# Altium schematic sheet DfMUX_DAC.SchDoc: Digital fMUX Mezzanine - DAC
size 386 x 246 mm; Engineer: M.Dobbs, McGill U.; Revision: 4
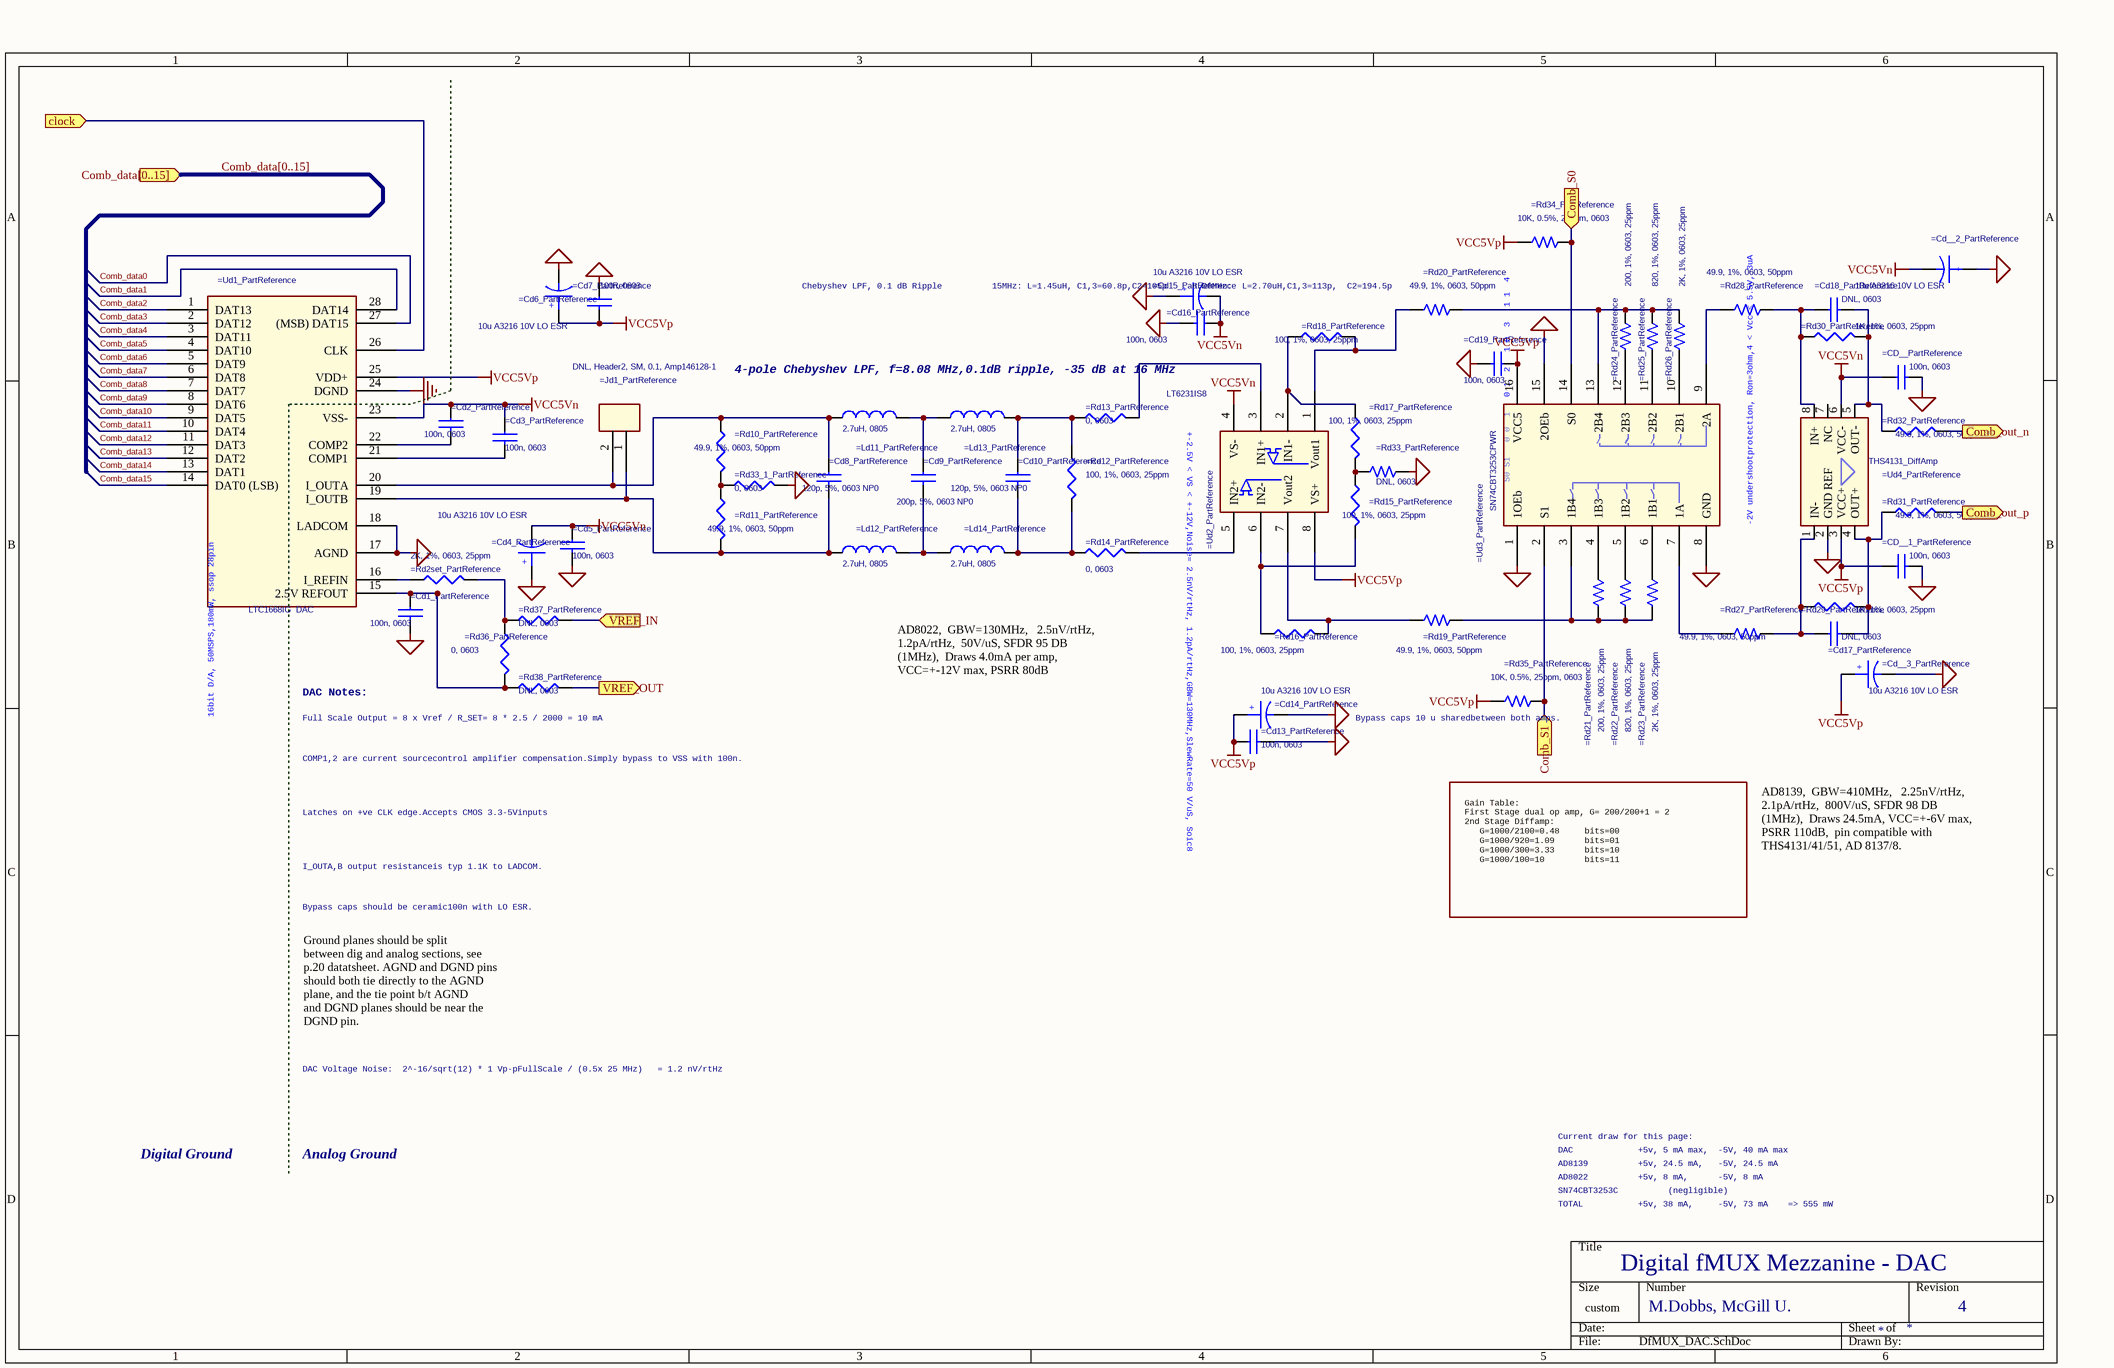
[diagram p0: DfMUX_DAC.SchDoc]

## Parts
=Cd1_PartReference  100n, 0603  [0603C]
=Cd2_PartReference  100n, 0603  [0603C]
=Cd3_PartReference  100n, 0603  [0603C]
=Cd4_PartReference  10u A3216 10V LO ESR  [TANTA]
=Cd5_PartReference  100n, 0603  [0603C]
=Cd6_PartReference  10u A3216 10V LO ESR  [TANTA]
=Cd7_PartReference  100n, 0603  [0603C]
=Cd8_PartReference  120p, 5%, 0603 NP0  [0603C]
=Cd9_PartReference  200p, 5%, 0603 NP0  [0603C]
=Cd10_PartReference  120p, 5%, 0603 NP0  [0603C]
=Cd13_PartReference  100n, 0603  [0603C]
=Cd14_PartReference  10u A3216 10V LO ESR  [TANTA]
=Cd15_PartReference  10u A3216 10V LO ESR  [TANTA]
=Cd16_PartReference  100n, 0603  [0603C]
=Cd17_PartReference  DNL, 0603  [0603C]
=Cd18_PartReference  DNL, 0603  [0603C]
=Cd19_PartReference  100n, 0603  [0603C]
=CD__1_PartReference  100n, 0603  [0603C]
=Cd__2_PartReference  10u A3216 10V LO ESR  [TANTA]
=Cd__3_PartReference  10u A3216 10V LO ESR  [TANTA]
=CD__PartReference  100n, 0603  [0603C]
=Jd1_PartReference  DNL, Header2, SM, 0.1, Amp146128-1  [HEADER_AMP146128]
=Ld11_PartReference  2.7uH, 0805  [0805L]
=Ld12_PartReference  2.7uH, 0805  [0805L]
=Ld13_PartReference  2.7uH, 0805  [0805L]
=Ld14_PartReference  2.7uH, 0805  [0805L]
=Rd2set_PartReference  2K, 1%, 0603, 25ppm  [0603R]
=Rd10_PartReference  49.9, 1%, 0603, 50ppm  [0603R]
=Rd11_PartReference  49.9, 1%, 0603, 50ppm  [0603R]
=Rd12_PartReference  100, 1%, 0603, 25ppm  [0603R]
=Rd13_PartReference  0, 0603  [0603R]
=Rd14_PartReference  0, 0603  [0603R]
=Rd15_PartReference  100, 1%, 0603, 25ppm  [0603R]
=Rd16_PartReference  100, 1%, 0603, 25ppm  [0603R]
=Rd17_PartReference  100, 1%, 0603, 25ppm  [0603R]
=Rd18_PartReference  100, 1%, 0603, 25ppm  [0603R]
=Rd19_PartReference  49.9, 1%, 0603, 50ppm  [0603R]
=Rd20_PartReference  49.9, 1%, 0603, 50ppm  [0603R]
=Rd21_PartReference  200, 1%, 0603, 25ppm  [0603R]
=Rd22_PartReference  820, 1%, 0603, 25ppm  [0603R]
=Rd23_PartReference  2K, 1%, 0603, 25ppm  [0603R]
=Rd24_PartReference  200, 1%, 0603, 25ppm  [0603R]
=Rd25_PartReference  820, 1%, 0603, 25ppm  [0603R]
=Rd26_PartReference  2K, 1%, 0603, 25ppm  [0603R]
=Rd27_PartReference  49.9, 1%, 0603, 50ppm  [0603R]
=Rd28_PartReference  49.9, 1%, 0603, 50ppm  [0603R]
=Rd29_PartReference  1K, 1%, 0603, 25ppm  [0603R]
=Rd30_PartReference  1K, 1%, 0603, 25ppm  [0603R]
=Rd31_PartReference  49.9, 1%, 0603, 50ppm  [0603R]
=Rd32_PartReference  49.9, 1%, 0603, 50ppm  [0603R]
=Rd33_1_PartReference  0, 0603  [0603R]
=Rd33_PartReference  DNL, 0603  [0603R]
=Rd34_PartReference  10K, 0.5%, 25ppm, 0603  [0603R]
=Rd35_PartReference  10K, 0.5%, 25ppm, 0603  [0603R]
=Rd36_PartReference  0, 0603  [0603R]
=Rd37_PartReference  DNL, 0603  [0603R]
=Rd38_PartReference  DNL, 0603  [0603R]
=Ud1_PartReference  LTC1668IG  DAC  [SOG.65M/28/WG8.20/L10.16]
=Ud2_PartReference  LT6231IS8  [SO8/L200]
=Ud3_PartReference  SN74CBT3253CPWR  [SOG.65M/16/PW]
=Ud4_PartReference  THS4131_DiffAmp  [SO8/L200]

## Ports
clock, Comb_data[0..15], Comb_out_n, Comb_out_p, Comb_S0, Comb_S1, VREF_IN, VREF_OUT

## Nets
GND_DIG: =Ud1_PartReference.24(DGND)
GND_SIGNAL: =Cd1_PartReference.2 =Cd4_PartReference.1 =Cd5_PartReference.2 =Cd6_PartReference.2 =Cd7_PartReference.1 =Cd13_PartReference.2 =Cd14_PartReference.2 =Cd15_PartReference.1 =Cd16_PartReference.2 =Cd19_PartReference.2 =CD__1_PartReference.2 =Cd__2_PartReference.1 =Cd__3_PartReference.2 =CD__PartReference.2 =Rd33_1_PartReference.2 =Rd33_PartReference.2 =Ud1_PartReference.17(AGND) =Ud1_PartReference.18(LADCOM) =Ud3_PartReference.1(1OEb) =Ud3_PartReference.8(GND) =Ud3_PartReference.15(2OEb) =Ud4_PartReference.2(GND_REF)
VCC5Vn: =Cd2_PartReference.1 =Cd3_PartReference.1 =Cd4_PartReference.2 =Cd5_PartReference.1 =Cd15_PartReference.2 =Cd16_PartReference.1 =Cd__2_PartReference.2 =CD__PartReference.1 =Ud1_PartReference.23(VSS-) =Ud2_PartReference.4(VS-) =Ud4_PartReference.6(VCC-)
VCC5Vp: =Cd6_PartReference.1 =Cd7_PartReference.2 =Cd13_PartReference.1 =Cd14_PartReference.1 =Cd19_PartReference.1 =CD__1_PartReference.1 =Cd__3_PartReference.1 =Rd34_PartReference.1 =Rd35_PartReference.1 =Ud1_PartReference.25(VDD+) =Ud2_PartReference.8(VS+) =Ud3_PartReference.16(VCC5) =Ud4_PartReference.3(VCC+)
clock: =Ud1_PartReference.26(CLK) ; port clock
Comb_data0: =Ud1_PartReference.27((MSB)_DAT15)
Comb_data1: =Ud1_PartReference.28(DAT14)
Comb_data2: =Ud1_PartReference.1(DAT13)
Comb_data3: =Ud1_PartReference.2(DAT12)
Comb_data4: =Ud1_PartReference.3(DAT11)
Comb_data5: =Ud1_PartReference.4(DAT10)
Comb_data6: =Ud1_PartReference.5(DAT9)
Comb_data7: =Ud1_PartReference.6(DAT8)
Comb_data8: =Ud1_PartReference.7(DAT7)
Comb_data9: =Ud1_PartReference.8(DAT6)
Comb_data10: =Ud1_PartReference.9(DAT5)
Comb_data11: =Ud1_PartReference.10(DAT4)
Comb_data12: =Ud1_PartReference.11(DAT3)
Comb_data13: =Ud1_PartReference.12(DAT2)
Comb_data14: =Ud1_PartReference.13(DAT1)
Comb_data15: =Ud1_PartReference.14(DAT0_(LSB))
Comb_out_n: =Rd32_PartReference.2 ; port Comb_out_n
Comb_out_p: =Rd31_PartReference.2 ; port Comb_out_p
Comb_S0: =Rd34_PartReference.2 =Ud3_PartReference.14(S0) ; port Comb_S0
Comb_S1: =Rd35_PartReference.2 =Ud3_PartReference.2(S1) ; port Comb_S1
VREF_IN: =Rd37_PartReference.2 ; port VREF_IN
VREF_OUT: =Rd38_PartReference.2 ; port VREF_OUT
Net=Cd1_PartReference_1: =Cd1_PartReference.1 =Rd36_PartReference.2 =Rd38_PartReference.1 =Ud1_PartReference.15(2.5V_REFOUT)
Net=Cd2_PartReference_2: =Cd2_PartReference.2 =Ud1_PartReference.22(COMP2)
Net=Cd3_PartReference_2: =Cd3_PartReference.2 =Ud1_PartReference.21(COMP1)
Net=Cd8_PartReference_1: =Cd8_PartReference.1 =Jd1_PartReference.2 =Ld11_PartReference.1 =Rd10_PartReference.1 =Ud1_PartReference.20(I_OUTA)
Net=Cd8_PartReference_2: =Cd8_PartReference.2 =Jd1_PartReference.1 =Ld12_PartReference.1 =Rd11_PartReference.2 =Ud1_PartReference.19(I_OUTB)
Net=Cd9_PartReference_1: =Cd9_PartReference.1 =Ld11_PartReference.2 =Ld13_PartReference.1
Net=Cd9_PartReference_2: =Cd9_PartReference.2 =Ld12_PartReference.2 =Ld14_PartReference.1
Net=Cd10_PartReference_1: =Cd10_PartReference.1 =Ld13_PartReference.2 =Rd12_PartReference.1 =Rd13_PartReference.1
Net=Cd10_PartReference_2: =Cd10_PartReference.2 =Ld14_PartReference.2 =Rd12_PartReference.2 =Rd14_PartReference.1
Net=Cd17_PartReference_1: =Cd17_PartReference.1 =Rd27_PartReference.2 =Rd29_PartReference.1 =Ud4_PartReference.1(IN-)
Net=Cd17_PartReference_2: =Cd17_PartReference.2 =Rd29_PartReference.2 =Rd31_PartReference.1 =Ud4_PartReference.4(OUT+)
Net=Cd18_PartReference_1: =Cd18_PartReference.1 =Rd28_PartReference.2 =Rd30_PartReference.1 =Ud4_PartReference.8(IN+)
Net=Cd18_PartReference_2: =Cd18_PartReference.2 =Rd30_PartReference.2 =Rd32_PartReference.1 =Ud4_PartReference.5(OUT-)
Net=Rd2set_PartReference_1: =Rd2set_PartReference.1 =Ud1_PartReference.16(I_REFIN)
Net=Rd2set_PartReference_2: =Rd2set_PartReference.2 =Rd36_PartReference.1 =Rd37_PartReference.1
Net=Rd10_PartReference_2: =Rd10_PartReference.2 =Rd11_PartReference.1 =Rd33_1_PartReference.1
Net=Rd13_PartReference_2: =Rd13_PartReference.2 =Ud2_PartReference.3(IN1+)
Net=Rd14_PartReference_2: =Rd14_PartReference.2 =Ud2_PartReference.5(IN2+)
Net=Rd15_PartReference_1: =Rd15_PartReference.1 =Rd17_PartReference.2 =Rd33_PartReference.1
Net=Rd15_PartReference_2: =Rd15_PartReference.2 =Rd16_PartReference.1 =Ud2_PartReference.6(IN2-)
Net=Rd16_PartReference_2: =Rd16_PartReference.2 =Rd19_PartReference.1 =Ud2_PartReference.7(Vout2)
Net=Rd17_PartReference_1: =Rd17_PartReference.1 =Rd18_PartReference.1 =Ud2_PartReference.2(IN1-)
Net=Rd18_PartReference_2: =Rd18_PartReference.2 =Rd20_PartReference.1 =Ud2_PartReference.1(Vout1)
Net=Rd19_PartReference_2: =Rd19_PartReference.2 =Rd21_PartReference.1 =Rd22_PartReference.1 =Rd23_PartReference.1 =Ud3_PartReference.3(1B4)
Net=Rd20_PartReference_2: =Rd20_PartReference.2 =Rd24_PartReference.2 =Rd25_PartReference.2 =Rd26_PartReference.2 =Ud3_PartReference.13(2B4)
Net=Rd21_PartReference_2: =Rd21_PartReference.2 =Ud3_PartReference.4(1B3)
Net=Rd22_PartReference_2: =Rd22_PartReference.2 =Ud3_PartReference.5(1B2)
Net=Rd23_PartReference_2: =Rd23_PartReference.2 =Ud3_PartReference.6(1B1)
Net=Rd24_PartReference_1: =Rd24_PartReference.1 =Ud3_PartReference.12(2B3)
Net=Rd25_PartReference_1: =Rd25_PartReference.1 =Ud3_PartReference.11(2B2)
Net=Rd26_PartReference_1: =Rd26_PartReference.1 =Ud3_PartReference.10(2B1)
Net=Rd27_PartReference_1: =Rd27_PartReference.1 =Ud3_PartReference.7(1A)
Net=Rd28_PartReference_1: =Rd28_PartReference.1 =Ud3_PartReference.9(2A)

Not connected (* = marked no-connect by the designer): =Ud4_PartReference 7(NC)

## Buses and harness runs
bus Comb_data[0..15] = port Comb_data[0..15]

## Notes on the sheet
- (near =Cd15_PartReference) Chebyshev LPF, 0.1 dB Ripple          15MHz: L=1.45uH, C1,3=60.8p,C2=105p     8.08MHz:  L=2.70uH,C1,3=113p,  C2=194.5p
- 4-pole Chebyshev LPF, f=8.08 MHz,0.1dB ripple, -35 dB at 16 MHz
- DAC Notes:
- Full Scale Output = 8 x Vref / R_SET= 8 * 2.5 / 2000 = 10 mA
- COMP1,2 are current sourcecontrol amplifier compensation.Simply bypass to VSS with 100n.
- AD8022,  GBW=130MHz,   2.5nV/rtHz,
  1.2pA/rtHz,  50V/uS, SFDR 95 DB
  (1MHz),  Draws 4.0mA per amp,
  VCC=+-12V max, PSRR 80dB
- (near =Rd35_PartReference) Bypass caps 10 u sharedbetween both amps.
- Latches on +ve CLK edge.Accepts CMOS 3.3-5Vinputs
- I_OUTA,B output resistanceis typ 1.1K to LADCOM.
- Bypass caps should be ceramic100n with LO ESR.
- Gain Table:
  First Stage dual op amp, G= 200/200+1 = 2
  2nd Stage Diffamp:
  G=1000/2100=0.48     bits=00
  G=1000/920=1.09      bits=01
  G=1000/300=3.33      bits=10
  G=1000/100=10        bits=11
- AD8139,  GBW=410MHz,   2.25nV/rtHz,
  2.1pA/rtHz,  800V/uS, SFDR 98 DB
  (1MHz),  Draws 24.5mA, VCC=+-6V max,
  PSRR 110dB,  pin compatible with
  THS4131/41/51, AD 8137/8.
- Ground planes should be split
  between dig and analog sections, see
  p.20 datatsheet. AGND and DGND pins
  should both tie directly to the AGND
  plane, and the tie point b/t AGND
  and DGND planes should be near the
  DGND pin.
- DAC Voltage Noise:  2^-16/sqrt(12) * 1 Vp-pFullScale / (0.5x 25 MHz)   = 1.2 nV/rtHz
- Digital Ground
- Analog Ground
- Current draw for this page:
- DAC             +5v, 5 mA max,  -5V, 40 mA max
- AD8139          +5v, 24.5 mA,   -5V, 24.5 mA
- AD8022          +5v, 8 mA,      -5V, 8 mA
- SN74CBT3253C          (negligible)
- TOTAL           +5v, 38 mA,     -5V, 73 mA    => 555 mW
- (in symbol AD8022AR_0) +-2.5V < VS < +-12V, / Noise= 2.5nV/rtHz, 1.2pA/rtHz, / GBW=130MHz, / SlewRate=50 V/uS, Soic8
- (in symbol CAPACITOR POL) +
- (in symbol LTC1668IG  DAC) 16bit D/A, 50MSPS, / 180mW, ssop 28pin
- (in symbol SN74CBT3253C 4MUX) S0 S1 / 0 0  1 / 0 1  2 / 1 0  3 / 1 1  4; -2V undershoot / protection, Ron=3ohm, / 4 < Vcc < 5.5V, 3uA

## Library data of the parts
=Cd1_PartReference =Cd2_PartReference =Cd3_PartReference =Cd8_PartReference =Cd9_PartReference =Cd10_PartReference =Cd18_PartReference = CAPACITOR NON-POL: COMPFIXED: NO; COMPGROUP: 0; COMPHEIGHT: 0.000; COMPROT: 270; COMPSIDE: TOP; COMPKEY: NO; COMPLOCKED: NO; DECOUPLER: NO; MEMORY: NO
  =Cd1_PartReference: COMPLOC: =Cd1_COMPLOC
  =Cd2_PartReference: COMPLOC: =Cd2_COMPLOC
  =Cd3_PartReference: COMPLOC: =Cd3_COMPLOC
  =Cd8_PartReference: COMPLOC: =Cd8_COMPLOC
  =Cd9_PartReference: COMPLOC: =Cd9_COMPLOC
  =Cd10_PartReference: COMPLOC: =Cd10_COMPLOC
  =Cd18_PartReference: COMPLOC: =Cd18_COMPLOC
=Cd4_PartReference =Cd__2_PartReference = CAPACITOR POL: COMPFIXED: NO; COMPGROUP: 0; COMPHEIGHT: 0.000; COMPROT: 180; COMPSIDE: BOT; COMPKEY: NO; COMPLOCKED: NO; DECOUPLER: NO; MEMORY: NO
  =Cd4_PartReference: COMPLOC: =Cd4_COMPLOC
  =Cd__2_PartReference: COMPLOC: =Cd__2_COMPLOC
=Cd5_PartReference = CAPACITOR NON-POL: COMPFIXED: NO; COMPGROUP: 0; COMPHEIGHT: 0.000; COMPSIDE: BOT; COMPKEY: NO; COMPLOCKED: NO; COMPROT: 0; DECOUPLER: NO; MEMORY: NO; COMPLOC: =Cd5_COMPLOC
=Cd6_PartReference =Cd14_PartReference = CAPACITOR POL: COMPFIXED: NO; COMPGROUP: 0; COMPHEIGHT: 0.000; COMPSIDE: BOT; COMPKEY: NO; COMPLOCKED: NO; COMPROT: 0; DECOUPLER: NO; MEMORY: NO
  =Cd6_PartReference: COMPLOC: =Cd6_COMPLOC
  =Cd14_PartReference: COMPLOC: =Cd14_COMPLOC
=Cd7_PartReference = CAPACITOR NON-POL: COMPFIXED: NO; COMPGROUP: 0; COMPHEIGHT: 0.000; COMPROT: 180; COMPSIDE: BOT; COMPKEY: NO; COMPLOCKED: NO; DECOUPLER: NO; MEMORY: NO; COMPLOC: =Cd7_COMPLOC
=Cd13_PartReference =Cd16_PartReference =CD__1_PartReference =CD__PartReference = CAPACITOR NON-POL: COMPFIXED: NO; COMPGROUP: 0; COMPHEIGHT: 0.000; COMPSIDE: TOP; COMPKEY: NO; COMPLOCKED: NO; COMPROT: 0; DECOUPLER: NO; MEMORY: NO
  =Cd13_PartReference: COMPLOC: =Cd13_COMPLOC
  =Cd16_PartReference: COMPLOC: =Cd16_COMPLOC
  =CD__1_PartReference: COMPLOC: =CD__1_COMPLOC
  =CD__PartReference: COMPLOC: =CD__COMPLOC
=Cd15_PartReference = CAPACITOR POL: COMPFIXED: NO; COMPGROUP: 0; COMPHEIGHT: 0.000; COMPSIDE: TOP; COMPKEY: NO; COMPLOCKED: NO; COMPROT: 0; DECOUPLER: NO; MEMORY: NO; COMPLOC: =Cd15_COMPLOC
=Cd17_PartReference = CAPACITOR NON-POL: COMPFIXED: NO; COMPGROUP: 0; COMPHEIGHT: 0.000; COMPROT: 90; COMPSIDE: TOP; COMPKEY: NO; COMPLOCKED: NO; DECOUPLER: NO; MEMORY: NO; COMPLOC: =Cd17_COMPLOC
=Cd19_PartReference = CAPACITOR NON-POL: COMPFIXED: NO; COMPGROUP: 0; COMPHEIGHT: 0.000; COMPROT: 180; COMPSIDE: TOP; COMPKEY: NO; COMPLOCKED: NO; DECOUPLER: NO; MEMORY: NO; COMPLOC: =Cd19_COMPLOC
=Cd__3_PartReference = CAPACITOR POL: COMPFIXED: NO; COMPGROUP: 0; COMPHEIGHT: 0.000; COMPROT: 180; COMPSIDE: BOT; FPLIST: 0603c; COMPKEY: NO; COMPLOCKED: NO; DECOUPLER: NO; MEMORY: NO; COMPLOC: =Cd__3_COMPLOC
=Jd1_PartReference = CONN_TRBLK_2: COMPFIXED: NO; COMPGROUP: 0; COMPHEIGHT: 0.000; COMPROT: 90; COMPSIDE: TOP; FPLIST: 0805L; COMPKEY: NO; COMPLOCKED: NO; DECOUPLER: NO; MEMORY: NO; COMPLOC: =Jd1_COMPLOC
=Ld11_PartReference =Ld12_PartReference =Ld13_PartReference =Ld14_PartReference = INDUCTOR/SM: COMPFIXED: NO; COMPGROUP: 0; COMPHEIGHT: 0.000; COMPSIDE: TOP; COMPKEY: NO; COMPLOCKED: NO; COMPROT: 0; DECOUPLER: NO; MEMORY: NO
  =Ld11_PartReference: COMPLOC: =Ld11_COMPLOC
  =Ld12_PartReference: COMPLOC: =Ld12_COMPLOC
  =Ld13_PartReference: COMPLOC: =Ld13_COMPLOC
  =Ld14_PartReference: COMPLOC: =Ld14_COMPLOC
=Rd2set_PartReference =Rd13_PartReference =Rd14_PartReference =Rd16_PartReference =Rd17_PartReference =Rd18_PartReference =Rd31_PartReference =Rd32_PartReference =Rd37_PartReference =Rd38_PartReference = R_Dup1: COMPFIXED: NO; COMPGROUP: 0; COMPHEIGHT: 0.000; COMPSIDE: TOP; COMPKEY: NO; COMPLOCKED: NO; DECOUPLER: NO; MEMORY: NO
  =Rd2set_PartReference: COMPROT: 0; COMPLOC: =Rd2set_COMPLOC
  =Rd13_PartReference: COMPROT: 0; COMPLOC: =Rd13_COMPLOC
  =Rd14_PartReference: COMPROT: 0; COMPLOC: =Rd14_COMPLOC
  =Rd16_PartReference: COMPROT: 0; COMPLOC: =Rd16_COMPLOC
  =Rd17_PartReference: COMPROT: 0; COMPLOC: =Rd17_COMPLOC
  =Rd18_PartReference: COMPROT: 0; COMPLOC: =Rd18_COMPLOC
  =Rd31_PartReference: COMPROT: =Rd31_COMPROT; COMPLOC: =Rd31_COMPLOC
  =Rd32_PartReference: COMPROT: 0; COMPLOC: =Rd32_COMPLOC
  =Rd37_PartReference: COMPROT: 0; COMPLOC: =Rd37_COMPLOC
  =Rd38_PartReference: COMPROT: 0; COMPLOC: =Rd38_COMPLOC
=Rd10_PartReference =Rd29_PartReference = R_Dup1: COMPFIXED: NO; COMPGROUP: 0; COMPHEIGHT: 0.000; COMPROT: 90; COMPSIDE: TOP; COMPKEY: NO; COMPLOCKED: NO; DECOUPLER: NO; MEMORY: NO
  =Rd10_PartReference: COMPLOC: =Rd10_COMPLOC
  =Rd29_PartReference: COMPLOC: =Rd29_COMPLOC
=Rd11_PartReference =Rd12_PartReference =Rd30_PartReference = R_Dup1: COMPFIXED: NO; COMPGROUP: 0; COMPHEIGHT: 0.000; COMPROT: 270; COMPSIDE: TOP; COMPKEY: NO; COMPLOCKED: NO; DECOUPLER: NO; MEMORY: NO
  =Rd11_PartReference: COMPLOC: =Rd11_COMPLOC
  =Rd12_PartReference: COMPLOC: =Rd12_COMPLOC
  =Rd30_PartReference: COMPLOC: =Rd30_COMPLOC
=Rd15_PartReference =Rd33_1_PartReference =Rd36_PartReference = R_Dup1: COMPFIXED: NO; COMPGROUP: 0; COMPHEIGHT: 0.000; COMPROT: 180; COMPSIDE: TOP; COMPKEY: NO; COMPLOCKED: NO; DECOUPLER: NO; MEMORY: NO
  =Rd15_PartReference: COMPLOC: =Rd15_COMPLOC
  =Rd33_1_PartReference: COMPLOC: =Rd33_1_COMPLOC
  =Rd36_PartReference: COMPLOC: =Rd36_COMPLOC
=Rd19_PartReference =Rd20_PartReference =Rd21_PartReference =Rd22_PartReference =Rd23_PartReference =Rd27_PartReference =Rd28_PartReference = R_Dup2: PSpiceTemplate: R^@REFDES %1 %2 ?TOLERANCE|R^@REFDES| @VALUE  ?TOLERANCE|\n.model R^@REFDES RES R=1 DEV=@TOLERANCE%|; COMPFIXED: NO; COMPGROUP: 0; COMPHEIGHT: 0.000; COMPSIDE: TOP; COMPKEY: NO; COMPLOCKED: NO; COMPROT: 0; DECOUPLER: NO; MEMORY: NO
  =Rd19_PartReference: Value: 49.9, 1%, 0603, 50ppm; COMPLOC: =Rd19_COMPLOC
  =Rd20_PartReference: Value: 49.9, 1%, 0603, 50ppm; COMPLOC: =Rd20_COMPLOC
  =Rd21_PartReference: Value: 200, 1%, 0603, 25ppm; COMPLOC: =Rd21_COMPLOC
  =Rd22_PartReference: Value: 820, 1%, 0603, 25ppm; COMPLOC: =Rd22_COMPLOC
  =Rd23_PartReference: Value: 2K, 1%, 0603, 25ppm; COMPLOC: =Rd23_COMPLOC
  =Rd27_PartReference: Value: 49.9, 1%, 0603, 50ppm; COMPLOC: =Rd27_COMPLOC
  =Rd28_PartReference: Value: 49.9, 1%, 0603, 50ppm; COMPLOC: =Rd28_COMPLOC
=Rd24_PartReference =Rd25_PartReference =Rd26_PartReference =Rd33_PartReference =Rd34_PartReference =Rd35_PartReference = R_Dup2: PSpiceTemplate: R^@REFDES %1 %2 ?TOLERANCE|R^@REFDES| @VALUE  ?TOLERANCE|\n.model R^@REFDES RES R=1 DEV=@TOLERANCE%|; COMPFIXED: NO; COMPGROUP: 0; COMPHEIGHT: 0.000; COMPROT: 180; COMPSIDE: TOP; COMPKEY: NO; COMPLOCKED: NO; DECOUPLER: NO; MEMORY: NO
  =Rd24_PartReference: Value: 200, 1%, 0603, 25ppm; COMPLOC: =Rd24_COMPLOC
  =Rd25_PartReference: Value: 820, 1%, 0603, 25ppm; COMPLOC: =Rd25_COMPLOC
  =Rd26_PartReference: Value: 2K, 1%, 0603, 25ppm; COMPLOC: =Rd26_COMPLOC
  =Rd33_PartReference: Value: DNL, 0603; COMPLOC: =Rd33_COMPLOC
  =Rd34_PartReference: Value: 10K, 0.5%, 25ppm, 0603; COMPLOC: =Rd34_COMPLOC
  =Rd35_PartReference: Value: 10K, 0.5%, 25ppm, 0603; COMPLOC: =Rd35_COMPLOC
=Ud1_PartReference = LTC1668IG  DAC: COMPFIXED: NO; COMPGROUP: 0; COMPHEIGHT: 0.000; COMPROT: 270; COMPSIDE: TOP; COMPKEY: NO; COMPLOCKED: NO; DECOUPLER: NO; MEMORY: NO; COMPLOC: =Ud1_COMPLOC
=Ud2_PartReference = AD8022AR_0: COMPFIXED: NO; COMPGROUP: 0; COMPHEIGHT: 0.000; COMPROT: 180; COMPSIDE: TOP; COMPKEY: NO; COMPLOCKED: NO; DECOUPLER: NO; MEMORY: NO; COMPLOC: =Ud2_COMPLOC
=Ud3_PartReference = SN74CBT3253C 4MUX: COMPFIXED: NO; COMPGROUP: 0; COMPHEIGHT: 0.000; COMPSIDE: TOP; COMPKEY: NO; COMPLOCKED: NO; COMPROT: 0; DECOUPLER: NO; MEMORY: NO; COMPLOC: =Ud3_COMPLOC
=Ud4_PartReference = THS4131_DiffAmp_0: COMPFIXED: NO; COMPGROUP: 0; COMPHEIGHT: 0.000; COMPSIDE: TOP; COMPKEY: NO; COMPLOCKED: NO; COMPROT: 0; DECOUPLER: NO; MEMORY: NO; COMPLOC: =Ud4_COMPLOC